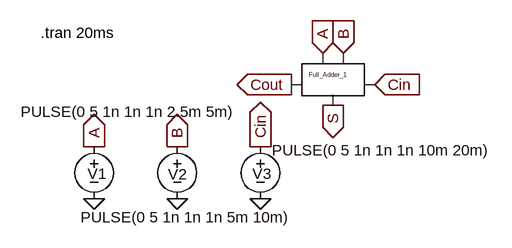
[diagram p0: schematic Simulation_Full_Adder.asc]
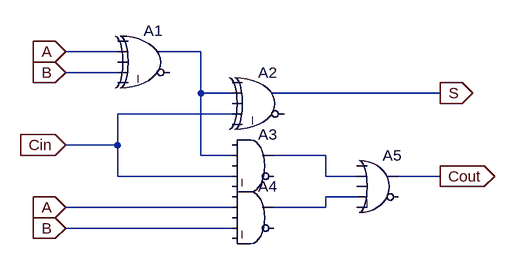
[diagram p1: sub-circuit full_adder.asc]
Simulation_Full_Adder.asc, the LTspice schematic file:
Version 4
SHEET 1 880 680
WIRE 176 112 176 96
WIRE 208 112 208 96
WIRE 144 144 128 144
WIRE 256 144 240 144
WIRE 192 176 192 160
FLAG 176 96 A
IOPIN 176 96 In
FLAG 208 96 B
IOPIN 208 96 In
FLAG 256 144 Cin
IOPIN 256 144 In
FLAG -176 320 0
FLAG -48 320 0
FLAG 80 320 0
FLAG 128 144 Cout
IOPIN 128 144 Out
FLAG 192 176 S
IOPIN 192 176 Out
FLAG -48 240 B
IOPIN -48 240 Out
FLAG 80 240 Cin
IOPIN 80 240 Out
FLAG -176 240 A
IOPIN -176 240 Out
SYMBOL Full_Adder 192 144 R0
SYMATTR InstName Full_Adder_1
SYMBOL voltage -176 224 R0
WINDOW 0 -10 57 Left 2
WINDOW 3 -113 -38 Left 2
WINDOW 123 0 0 Left 0
WINDOW 39 0 0 Left 0
SYMATTR InstName V1
SYMATTR Value PULSE(0 5 1n 1n 1n 2.5m 5m)
SYMBOL voltage -48 224 R0
WINDOW 0 -14 58 Left 2
WINDOW 3 -149 124 Left 2
WINDOW 123 0 0 Left 0
WINDOW 39 0 0 Left 0
SYMATTR InstName V2
SYMATTR Value PULSE(0 5 1n 1n 1n 5m 10m)
SYMBOL voltage 80 224 R0
WINDOW 0 -12 57 Left 2
WINDOW 3 18 21 Left 2
WINDOW 123 0 0 Left 0
WINDOW 39 0 0 Left 0
SYMATTR InstName V3
SYMATTR Value PULSE(0 5 1n 1n 1n 10m 20m)
TEXT -258 64 Left 2 !.tran 20ms

full_adder.asc, the sub-circuit schematic file:
Version 4
SHEET 1 880 680
WIRE 64 48 -16 48
WIRE 192 48 128 48
WIRE 64 80 -16 80
WIRE 192 112 192 48
WIRE 240 112 192 112
WIRE 560 112 304 112
WIRE 240 144 64 144
WIRE 64 192 64 144
WIRE 64 192 -16 192
WIRE 192 208 192 112
WIRE 240 208 192 208
WIRE 384 208 304 208
WIRE 64 240 64 192
WIRE 240 240 64 240
WIRE 384 240 384 208
WIRE 432 240 384 240
WIRE 560 240 496 240
WIRE 432 272 384 272
WIRE 240 288 -16 288
WIRE 384 288 384 272
WIRE 384 288 304 288
WIRE 240 320 -16 320
FLAG -16 48 A
IOPIN -16 48 In
FLAG -16 80 B
IOPIN -16 80 In
FLAG -16 192 Cin
IOPIN -16 192 In
FLAG -16 288 A
IOPIN -16 288 In
FLAG -16 320 B
IOPIN -16 320 In
FLAG 560 112 S
IOPIN 560 112 Out
FLAG 560 240 Cout
IOPIN 560 240 Out
SYMBOL Digital\\xor 112 0 R0
SYMATTR InstName A1
SYMBOL Digital\\xor 288 64 R0
SYMATTR InstName A2
SYMBOL Digital\\and 272 160 R0
SYMATTR InstName A3
SYMBOL Digital\\and 272 240 R0
SYMATTR InstName A4
SYMBOL Digital\\or 464 192 R0
SYMATTR InstName A5

The netlist it stands for:
* Simulation_Full_Adder.asc
XFull_Adder_1 A B Cin Cout S full_adder
V1 A 0 PULSE(0 5 1n 1n 1n 2.5m 5m)
V2 B 0 PULSE(0 5 1n 1n 1n 5m 10m)
V3 Cin 0 PULSE(0 5 1n 1n 1n 10m 20m)

* block symbol definitions
.subckt full_adder A B Cin Cout S
A1 0 A 0 B 0 0 N001 0 XOR
A2 0 N001 0 Cin 0 0 S 0 XOR
A3 0 N001 0 Cin 0 0 N002 0 AND
A4 0 A 0 B 0 0 N003 0 AND
A5 0 N002 0 N003 0 0 Cout 0 OR
.ends full_adder

.tran 20ms
.backanno
.end